# Altium schematic sheet ATTinySchematic.SchDoc
size A
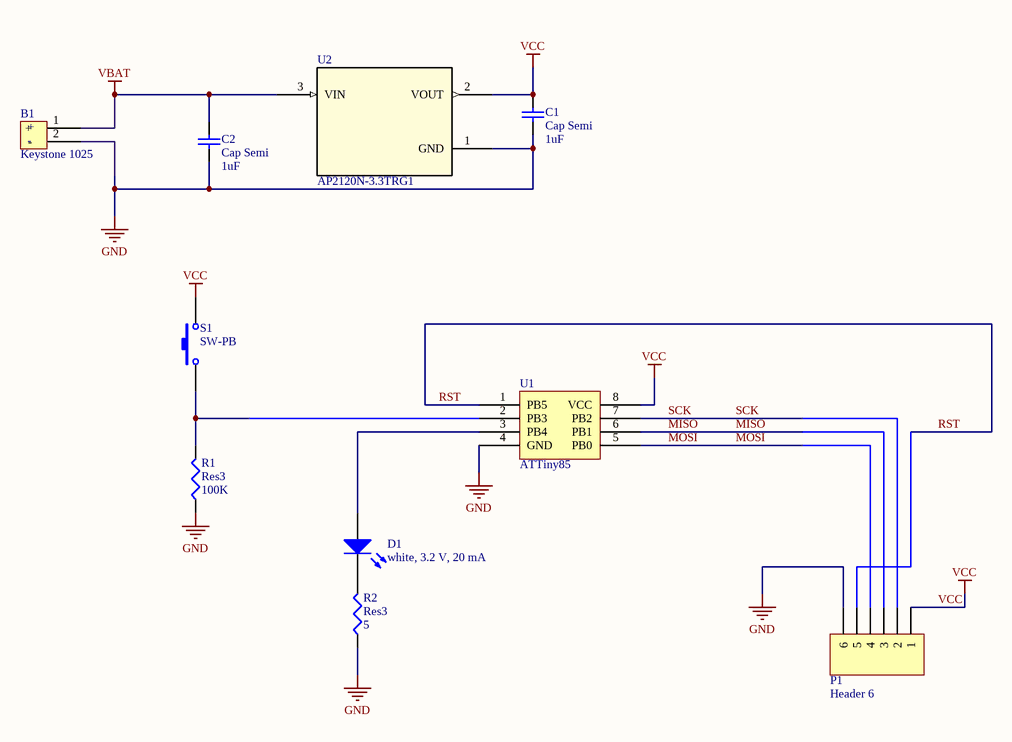
[diagram p0: ATTinySchematic.SchDoc]

## Parts
B1  Keystone 1025  [1025]
C1  Cap Semi  value 1uF  [1608[0603]]
C2  Cap Semi  value 1uF  [1608[0603]]
D1  white, 3.2 V, 20 mA  [HDR1X2]
P1  Header 6  [HDR1X6]
R1  Res3  value 100K  [J1-0603]
R2  Res3  value 5  [J1-0603]
S1  SW-PB  [SPST-2]
U1  ATTiny85  [8S2]
U2  AP2120N-3.3TRG1  [SOT-23]

## Nets
GND: B1.2(-) C1.1 C2.1 P1.6 R1.1 R2.1 U1.4(GND) U2.1(GND)
VBAT: B1.1(+) C2.2 U2.3(VIN)
VCC: C1.2 P1.1 S1.2 U1.8(VCC) U2.2(VOUT)
MISO: P1.3 U1.6(PB1)
MOSI: P1.4 U1.5(PB0)
RST: P1.5 U1.1(PB5)
SCK: P1.2 U1.7(PB2)
NetD1_1: D1.1(A) R2.2
NetD1_2: D1.2(K) U1.3(PB4)
NetR1_2: R1.2 S1.1 U1.2(PB3)

## Library data of the parts
B1 = Keystone 1025: BATT HOLDER COIN 1/2 CELL PC PIN
C1 C2 = Cap Semi: Capacitor (Semiconductor SIM Model); Published: 8-Jun-2000; LatestRevisionDate: 29-May-2009; LatestRevisionNote: IPC-7351 Footprint Added.; PackageReference: C1206; Publisher: Altium Limited; PackageDescription: Chip Capacitor
D1 = LED2: Typical RED, GREEN, YELLOW, AMBER GaAs LED; Published: 8-Jun-2000; LatestRevisionDate: 17-Jul-2002; LatestRevisionNote: Re-released for DXP Platform.; PackageVersion: Feb-2002; PackageReference: 3.2X1.6X1.1; Publisher: Altium Limited; PackageDescription: SM LED; 2 Flat Leads
P1 = Header 6: Header, 6-Pin; LatestRevisionDate: 17-Jul-2002; LatestRevisionNote: Re-released for DXP Platform.; Publisher: Altium Limited
R1 R2 = Res3: Resistor; Published: 8-Jun-2000; LatestRevisionDate: 29-May-2009; LatestRevisionNote: IPC-7351 Footprint Added.; PackageReference: J1-0603; Publisher: Altium Limited; PackageDescription: Chip Resistor
S1 = SW-PB: Switch; Published: 24-Mar-1999; LatestRevisionDate: 17-Jul-2002; LatestRevisionNote: Re-released for DXP Platform.; PackageReference: SPST-2; Publisher: Altium Limited; PackageDescription: Switch; 2 Leads
U2 = AP2120N-3.3TRG1: IC REG LINEAR 3.3V 150MA SOT23; Vendor: Diodes Inc; Built_By: EMA_UL_Team; Manufacturer_Part_Number: AP2120N-3.3TRG1; RefDes: RefDes; Type: DEV; Value: Value